# EAGLE design so14-breakout (EAGLE 6.2)
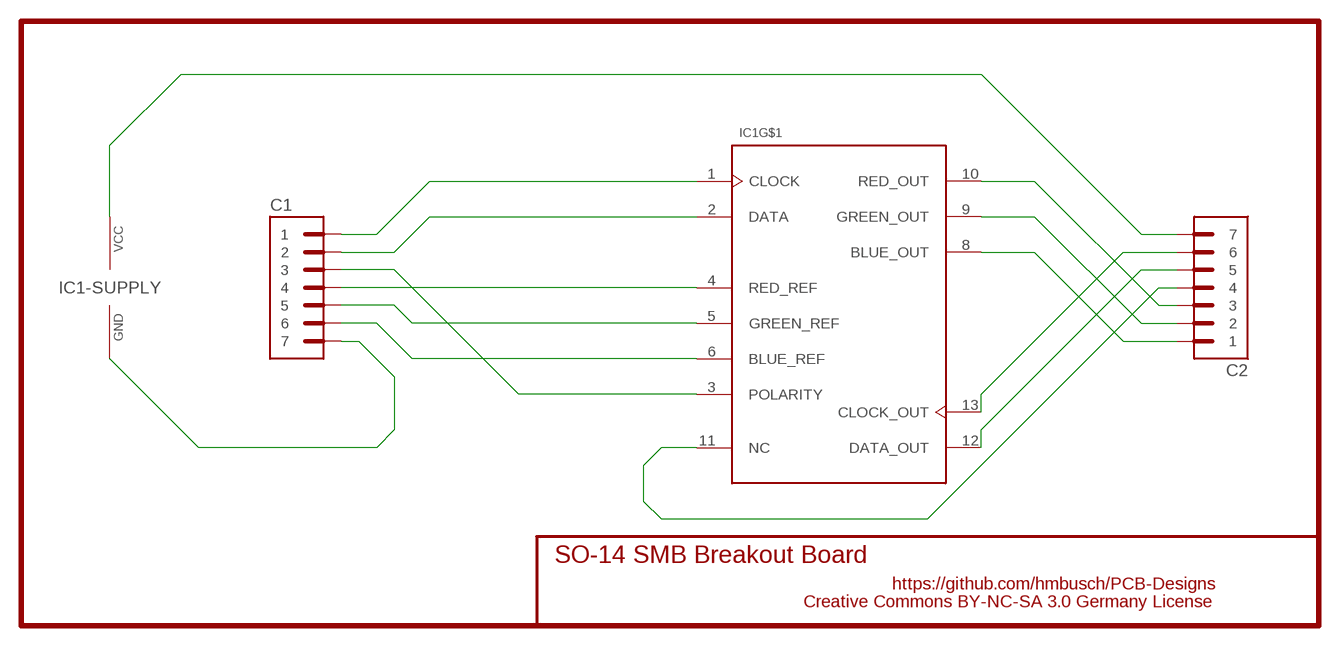
[diagram p0: schematic, sheet 1]

## Parts
C1  PIN_HEADER_7-WIDE  [BREAKAWAY_STRAIGHT_7_WIDE]
C2  PIN_HEADER_7-WIDE  [BREAKAWAY_STRAIGHT_7_WIDE]
IC1  WS2801-SO14  [SO-14]

## Nets
GND: C1.7 IC1.7(-SUPPLY:GND)
N$1: C1.1 IC1.1(CLOCK)
N$2: C1.2 IC1.2(DATA)
N$3: C1.3 IC1.3(POLARITY)
N$4: C1.4 IC1.4(RED_REF)
N$5: C1.5 IC1.5(GREEN_REF)
N$6: C1.6 IC1.6(BLUE_REF)
N$8: C2.1 IC1.8(BLUE_OUT)
N$9: C2.2 IC1.9(GREEN_OUT)
N$10: C2.3 IC1.10(RED_OUT)
N$11: C2.5 IC1.12(DATA_OUT)
N$12: C2.6 IC1.13(CLOCK_OUT)
N$13: C2.7 IC1.14(-SUPPLY:VCC)
N$14: C2.4 IC1.11(NC)

## Notes on the sheet
- SO-14 SMB Breakout Board
- https://github.com/hmbusch/PCB-Designs
- Creative Commons BY-NC-SA 3.0 Germany License

## Library data of the parts
C1 C2 = icmi-connectors:PIN_HEADER_7
IC1 = icmi-ics:WS2801: WS2801 - 3-Channel Constant Current LED Driver With Programmable PWM Outputs

## Board
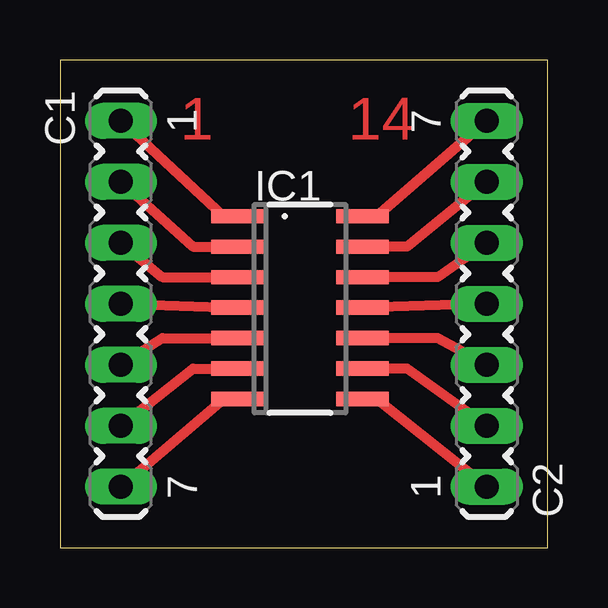
[diagram p1: board, top side]

Size 20.32 x 20.32 mm. Coordinates in mm from the lower left corner, seen from the top.
Outline: 0,0 20.32,0 20.32,20.32 0,20.32 0,0
Copper layers (1*16): Top 0.035mm / dielectric 1.5mm / Bottom 0.035mm
Design rules: minimum track width 10mil, minimum drill 24mil, track to track 8mil, track to pad 8mil, pad to pad 8mil, via to via 8mil, smd to smd 8mil, copper to edge 40mil, drill to drill 8mil, minimum pad ring 10mil, minimum via ring 8mil, stop-mask expansion 4mil, vias tented up to drill 0mil, thermal gap 10mil
tRestrict: area 6,5 to 14,15

### Footprints (pad centres in the part's own frame; a part is rotated, then mirrored left to right if it is on the bottom)
BREAKAWAY_STRAIGHT_7_WIDE = drill 1 long: 1 0,-7.62; 2 0,-5.08; 3 0,-2.54; 4 0,0; 5 0,2.54; 6 0,5.08; 7 0,7.62
SO-14 = smd 0.6 x 2.2: 1 -3.81,-2.6; 2 -2.54,-2.6; 3 -1.27,-2.6; 4 0,-2.6; 5 1.27,-2.6; 6 2.54,-2.6; 7 3.81,-2.6; 8 3.81,2.6; 9 2.54,2.6; 10 1.27,2.6; 11 0,2.6; 12 -1.27,2.6; 13 -2.54,2.6; 14 -3.81,2.6

### Placement (x,y rotation side)
C1  2.54,10.16 180 top
C2  17.78,10.16 0 top
IC1  10,10 270 top

### Tracks (layer width: path | path; a pad name or v marks a point on that pad's centre or on a via)
GND
  Top 0.406: C1.7 6.81,6.19 IC1.7
N$1
  Top 0.406: C1.1 6.81,13.81 IC1.1
N$2
  Top 0.406: C1.2 5.54,12.54 IC1.2
N$3
  Top 0.406: C1.3 4.27,11.27 IC1.3
N$4
  Top 0.406: C1.4 IC1.4
N$5
  Top 0.406: C1.5 4.27,8.73 IC1.5
N$6
  Top 0.406: C1.6 5.54,7.46 IC1.6
N$8
  Top 0.406: C2.1 13.19,6.19 IC1.8
N$9
  Top 0.406: C2.2 14.46,7.46 IC1.9
N$10
  Top 0.406: C2.3 15.73,8.73 IC1.10
N$11
  Top 0.406: C2.5 15.73,11.27 IC1.12
N$12
  Top 0.406: C2.6 14.46,12.54 IC1.13
N$13
  Top 0.406: C2.7 13.19,13.81 IC1.14
N$14
  Top 0.406: C2.4 IC1.11

### Text on the board
Top: 1 | 14